# Altium project GCS_H7.PrjPcb (part 1 of 2)
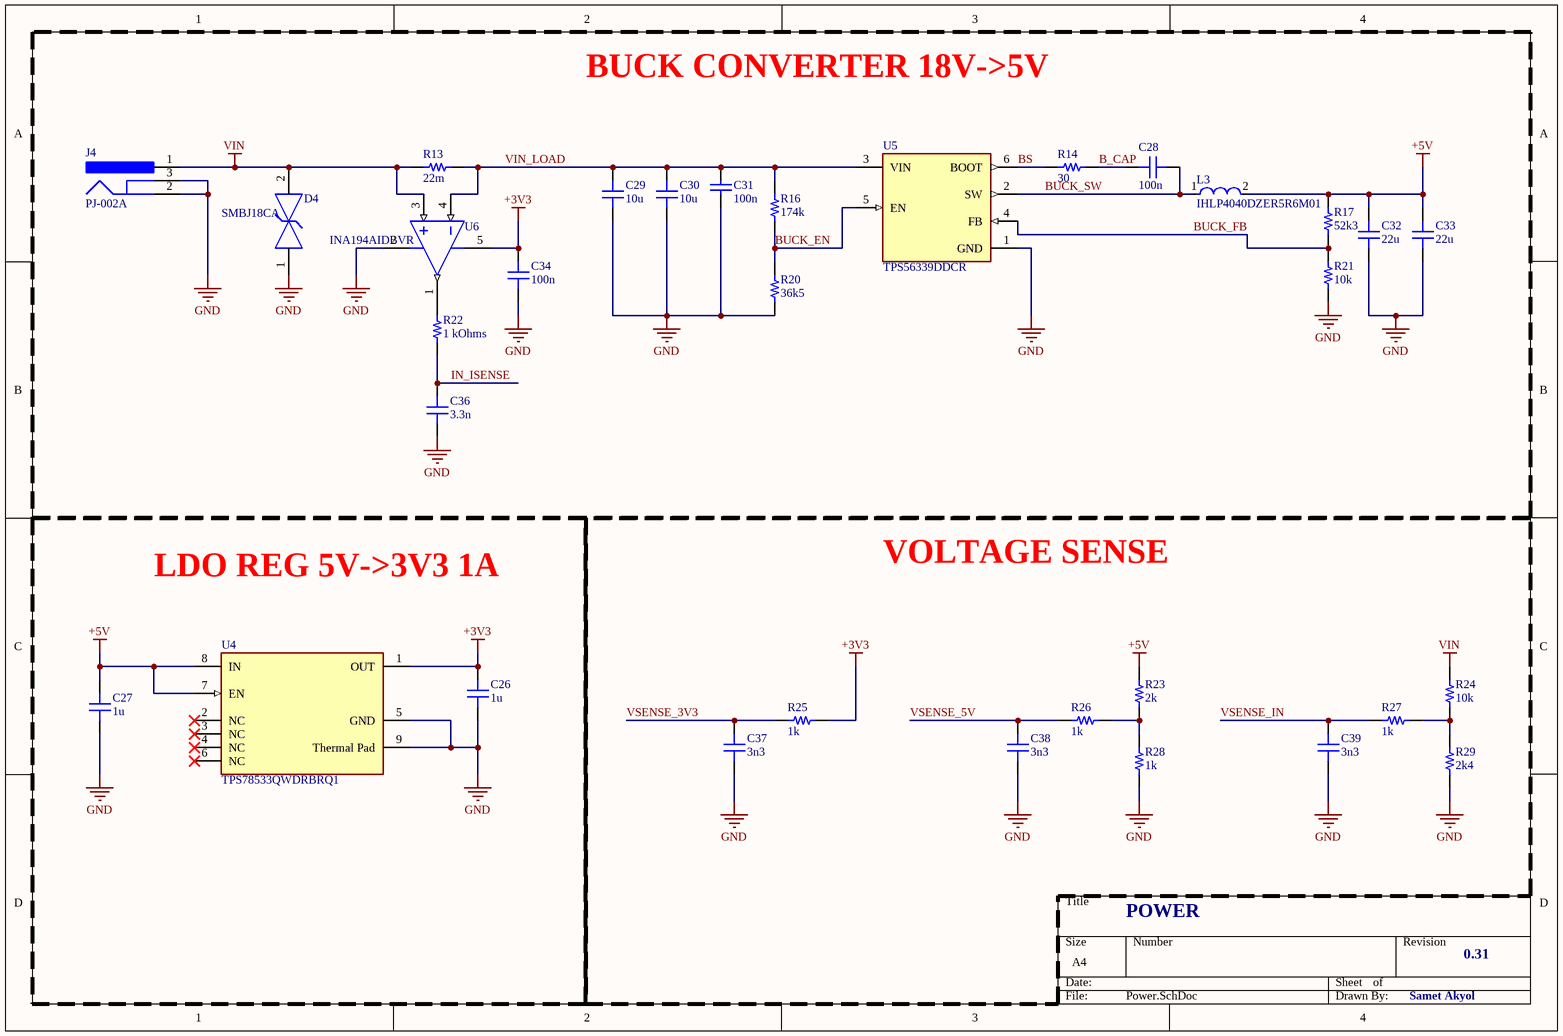
[diagram p0: Power.SchDoc]
5 sheets, 120 parts. Net scope: global (net labels, ports and power ports of the same name join across sheets).
Board file: PCB1.PcbDoc
Sheets:
  Power.SchDoc
  Microcontroller.SchDoc
  Ethernet.SchDoc
  Peripheral.SchDoc
  IcantFindFileName.SchDoc

## Sheet Power.SchDoc
size A4; SheetNumber: 1; SheetTotal: 6

### Parts
C26  1u  [CAP 0603_1608]
C27  1u  [CAP 0603_1608]
C28  100n  [CAP 0603_1608]
C29  10u  [CAP 0805_2012]
C30  10u  [CAP 0805_2012]
C31  100n  [CAPC2013X145X20LL20]
C32  22u  [CAP 0805_2012]
C33  22u  [CAP 0805_2012]
C34  100n  [CAP 0402_1005]
C36  3.3n  [CAP 0402_1005]
C37  3n3  [CAP 0402_1005]
C38  3n3  [CAP 0402_1005]
C39  3n3  [CAP 0402_1005]
D4  SMBJ18CA  [FP-SMBJ-MFG]
J4  PJ-002A  [CUI-PJ-002A_V]
L3  IHLP4040DZER5R6M01  [FP-IHLP-4040DZ-FP_3_124x3-MFG]
R13  22m  [STACKPOLE CSM2512]
R14  30  [RES 0402_1005]
R16  174k  [RES 0402_1005]
R17  52k3  [RES 0603_1608]
R20  36k5  [RES 0402_1005]
R21  10k  [RES 0603_1608]
R22  1 kOhms  [RES 0402_1005]
R23  2k  [RES 0402_1005]
R24  10k  [RES 0402_1005]
R25  1k  [RES 0402_1005]
R26  1k  [RES 0402_1005]
R27  1k  [RES 0402_1005]
R28  1k  [RES 0402_1005]
R29  2k4  [RES 0402_1005]
U4  TPS78533QWDRBRQ1  [FP-DRB0008J-MFG]
U5  TPS56339DDCR  [FP-DDC0006A-MFG]
U6  INA194AIDBVR  [DBV0005A_M]

### Blocks framed on the sheet
BUCK CONVERTER 18V->5V: C28-C34 C36 D4 J4 L3 R13 R14 R16 R17 R20-R22 U5 U6
LDO REG 5V->3V3 1A: C26 C27 U4
VOLTAGE SENSE: C37-C39 R23-R29

### Nets
+3V3: C26.2 C34.2 R25.2 U4.1(OUT) U6.5(V+)
+5V: C27.2 C32.2 C33.2 L3.2 R17.2 R23.1 U4.7(EN) U4.8(IN)
GND: C26.1 C27.1 C29.1 C30.1 C31.1 C32.1 C33.1 C34.1 C36.1 C37.1 C38.1 C39.1 D4.1 J4.2 J4.3 R20.1 R21.1 R28.2 R29.2 U4.5(GND) U4.9(Thermal_Pad) U5.1(GND) U6.2(GND)
VIN: D4.2 J4.1 R13.1 R24.1 U6.3(VIN+)
B_CAP: C28.1 R14.1
BS: R14.2 U5.6(BOOT)
BUCK_EN: R16.1 R20.2 U5.5(EN)
BUCK_FB: R17.1 R21.2 U5.4(FB)
BUCK_SW: C28.2 L3.1 U5.2(SW)
IN_ISENSE: C36.2 R22.1
VIN_LOAD: C29.2 C30.2 C31.2 R13.2 R16.2 U5.3(VIN) U6.4(VIN-)
VSENSE_3V3: C37.2 R25.1
VSENSE_5V: C38.2 R26.1
VSENSE_IN: C39.2 R27.1
NetR22_2: R22.2 U6.1(OUT)
NetR23_2: R23.2 R26.2 R28.1
NetR24_2: R24.2 R27.2 R29.1

Not connected (* = marked no-connect by the designer): U4 2(NC)* 3(NC)* 4(NC)* 6(NC)*

### Notes on the sheet
- POWER
- 0.31
- Samet Akyol

### Library data of the parts
C26 = GRT188R61C106ME13D: CAP CER 10UF 16V X5R 0603; manufacturer: Murata Electronics; Capacitance: 10 µF; Tolerance: ±20%; Part Number: GRT188R61C106ME13D; Value: 1u; Applications: Automotive; componentlink1description: Datasheet; componentlink1url: https://search.murata.co.jp/Ceramy/image/img/A01X/G101/ENG/GRT188R61C106ME13-01.pdf; componentlink2description: DigiKey Link; componentlink2url: https://www.digikey.com/en/products/detail/murata-electronics/GRT188R61C106ME13D/5416740; Device Package: 0603 (1608 Metric); lastupdated: 9.02.2024 20:10:30; Lifecycle Status: Active; Minimum Order: 1; Mounting Type: Surface Mount, MLCC; Operating Temperature: -55°C ~ 85°C; Package / Case: 0603 (1608 Metric); packaging: TapeAndReel; partid: 2515; Part Status: Active; price: 0.06; Ratings: AEC-Q200; series: GRT; Size / Dimension: 0.063" L x 0.031" W (1.60mm x 0.80mm); Supplier 1: DigiKey; Supplier Part Number 1: 490-12318-1-ND; Temperature Coefficient: X5R; Thickness (Max): 0.035" (0.90mm); Voltage - Rated: 16V
C27 = 0603YD105MAT2A: CAP CER 1UF 16V X5R 0603; manufacturer: AVX Corporation; Capacitance: 1µF; Tolerance: ±20%; Part Number: 0603YD105MAT2A; Value: 1u; Applications: General Purpose; componentlink1description: Datasheet; componentlink1url: http://datasheets.avx.com/cx5r.pdf; componentlink2description: DigiKey Link; componentlink2url: http://digikey.com/product-detail/en/avx-corporation/0603YD105MAT2A/478-5319-1-ND/1950986; Device Package: 0603 (1608 Metric); lastupdated: 2.09.2020 01:03:35; Lifecycle Status: Active; Minimum Order: 1; Mounting Type: Surface Mount, MLCC; Operating Temperature: -55°C ~ 85°C; Package / Case: 0603 (1608 Metric); packaging: TapeAndReel; partid: 2864; Part Status: Active; price: 0.02; series: -; Size / Dimension: 0.063" L x 0.032" W (1.60mm x 0.81mm); Supplier 1: DigiKey; Supplier Part Number 1: 478-5319-1-ND; Temperature Coefficient: X5R; Thickness (Max): 0.035" (0.90mm); Voltage - Rated: 16V
C28 = MD0603BW106M100NHT-EM: CAP CER 10UF 10V X5R 0603; manufacturer: Knowles Novacap; Capacitance: 10 µF; Tolerance: ±20%; Part Number: MD0603BW106M100NHT-EM; Value: 100n; Applications: Medical, Non-Critical; componentlink1description: Datasheet; componentlink1url: https://mm.digikey.com/Volume0/opasdata/d220001/medias/docus/5546/MD Series R3.pdf; componentlink2description: DigiKey Link; componentlink2url: https://www.digikey.com/en/products/detail/knowles-novacap/MD0603BW106M100NHT-EM/21406876; Device Package: 0603 (1608 Metric); lastupdated: 9.02.2024 20:08:38; Lifecycle Status: Active; Minimum Order: 1; Mounting Type: Surface Mount, MLCC; Operating Temperature: -55°C ~ 85°C; Package / Case: 0603 (1608 Metric); packaging: TapeAndReel; partid: 56748; price: 0.24; series: MD; Supplier 1: DigiKey; Supplier Part Number 1: 1763-MD0603BW106M100NHT-EMCT-ND; Temperature Coefficient: X5R; Voltage - Rated: 10V
C29 C30 = C2012X6S1C106K125AC: CAP CER 10UF 16V X6S 0805; manufacturer: TDK Corporation; Capacitance: 10 µF; Tolerance: ±10%; Part Number: C2012X6S1C106K125AC; Value: 10u; Applications: General Purpose; componentlink1description: Datasheet; componentlink1url: https://product.tdk.com/info/en/catalog/datasheets/mlcc_commercial_general_en.pdf?ref_disty=digikey; componentlink2description: DigiKey Link; componentlink2url: https://www.digikey.com/en/products/detail/tdk-corporation/C2012X6S1C106K125AC/2733046; Device Package: 0805 (2012 Metric); Features: Low ESL; lastupdated: 9.02.2024 20:16:08; Lifecycle Status: Active; Minimum Order: 1; Mounting Type: Surface Mount, MLCC; Operating Temperature: -55°C ~ 105°C; Package / Case: 0805 (2012 Metric); packaging: TapeAndReel; partid: 2995; Part Status: Active; price: 0.06; series: C; Size / Dimension: 0.079" L x 0.049" W (2.00mm x 1.25mm); Supplier 1: DigiKey; Supplier Part Number 1: 445-7611-1-ND; Temperature Coefficient: X6S; Thickness (Max): 0.057" (1.45mm); Voltage - Rated: 16V
C31 = CMP-2000-07557-1: Chip Capacitor, 0.1 uF, +/- 10%, 50 V, -55 to 125 degC, 0805 (2012 Metric), RoHS, Tape and Reel; Manufacturer: TDK; Voltage Rating: 50V; Dielectric Material: Ceramic; Capacitance: 100nF; Dielectric: X7R; Datasheet Version: 07/2017; Max Operating Temperature: 125degC; RoHSCompliant: True; Min Operating Temperature: -55degC; Case/Package: 0805; Composition: Ceramic; Width: 0.049inch; Thickness: 0.037inch; Datasheet URL: https://product.tdk.com/info/en/catalog/datasheets/mlcc_commercial_general_en.pdf; Height: 0.85mm; Voltage Rating (DC): 50V; Voltage: 50V; Packaging: TapeandReel; Mounting Technology: SurfaceMount; Case Code (Metric): 2012; Length: 2mm; Radiation Hardening: No; Number of Pins: 2; REACH SVHC: NoSVHC; Lead Free: LeadFree; Package Reference: 805; Weight: 0.000194oz; Tolerance: 10%; Package Description: 2-Pin Surface Mount Device, Body 2 x 1.25 mm; Manufacturer URL: http://www.tdk.com/; Package Quantity: 1; Case Code (Imperial): 0805; Mount: SurfaceMount; Depth: 1.25mm; Termination: SMD/SMT
C32 C33 = CL21A226KOQNNNG: CAP CER 22UF 16V X5R 0805; manufacturer: Samsung Electro-Mechanics; Capacitance: 22 µF; Tolerance: ±10%; Part Number: CL21A226KOQNNNG; Value: 22u; Applications: General Purpose; componentlink1description: Datasheet; componentlink1url: //media.digikey.com/pdf/Data%20Sheets/Samsung%20PDFs/CL21A226KOQNNNG_Spec.pdf; componentlink2description: DigiKey Link; componentlink2url: https://www.digikey.com/en/products/detail/samsung-electro-mechanics/CL21A226KOQNNNG/3894433; Device Package: 0805 (2012 Metric); lastupdated: 9.02.2024 20:16:07; Lifecycle Status: Active; Minimum Order: 1; Mounting Type: Surface Mount, MLCC; Operating Temperature: -55°C ~ 85°C; Package / Case: 0805 (2012 Metric); packaging: TapeAndReel; partid: 3000; Part Status: Active; price: 0.06; series: CL; Size / Dimension: 0.079" L x 0.049" W (2.00mm x 1.25mm); Supplier 1: DigiKey; Supplier Part Number 1: 1276-7092-1-ND; Temperature Coefficient: X5R; Thickness (Max): 0.055" (1.40mm); Voltage - Rated: 16V
C34 C36-C39 = GRM155C71A105KE11D: CAP CER 1UF 10V X7S 0402; manufacturer: Murata Electronics; Capacitance: 1 µF; Tolerance: ±10%; Part Number: GRM155C71A105KE11D; Applications: General Purpose; componentlink1description: Datasheet; componentlink1url: https://search.murata.co.jp/Ceramy/image/img/A01X/G101/ENG/GRM155C71A105KE11-01.pdf; componentlink2description: DigiKey Link; componentlink2url: https://www.digikey.com/en/products/detail/murata-electronics/GRM155C71A105KE11D/6606086; Device Package: 0402 (1005 Metric); lastupdated: 9.02.2024 20:04:38; Lifecycle Status: Active; Minimum Order: 1; Mounting Type: Surface Mount, MLCC; Operating Temperature: -55°C ~ 125°C; Package / Case: 0402 (1005 Metric); packaging: TapeAndReel; partid: 1749; Part Status: Active; price: 0.01; series: GRM; Size / Dimension: 0.039" L x 0.020" W (1.00mm x 0.50mm); Supplier 1: DigiKey; Supplier Part Number 1: 490-14457-1-ND; Temperature Coefficient: X7S; Thickness (Max): 0.024" (0.60mm); Voltage - Rated: 10V
  C34: Value: 100n
  C36: Value: 3.3n
  C37-C39: Value: 3n3
D4 = CMP-08607-000021-1: TVS DIODE 18V 29.2V DO214AA; Manufacturer: Littelfuse Inc; Number Of Channels: 1; Peak Pulse Power: 600W; Max Junction Temp: +150°C; Peak Pulse Current: 20.6A; Direction: Bidirectional; Breakdown Voltage: 20V; RoHS: TRUE; Lead Free: Yes; Category: Diode; Clamping Voltage: 29.2V; Height: 2.61mm; Manufacturer Part Number: SMBJ18CA; Reverse Standoff Voltage: 18V; Device Class L3: unset; Device Class L2: TVS Diodes; Package: SMBJ; Digikey Description: TVS DIODE 18V 29.2V DO214AA; Device Class L1: Circuit Protection; ComponentLink2Description: Datasheet; ComponentLink2URL: https://www.littelfuse.com/~/media/electronics/datasheets/tvs_diodes/littelfuse_tvs_diode_smbj_datasheet.pdf.pdf; Temperature: -65°C to +150°C; Temperature Range High: +150°C; Mouser Description: SMBJ Series 29.2 V 0.6 kW Surface Mount Bi-Directional TVS Diode - DO-214AA; Automotive: No; Octopart: https://octopart.com/smbj18ca-littelfuse-350695; Temperature Range Low: -65°C
J4 = CMP-2000-06895-2: Through Hole Right Angle DC Power Jack, 2.5 A, 2 mm Center Pin, 3 Position, -25 to 85 degC, RoHS, Bulk; Manufacturer: CUIInc.; Brand: CUI; Inside Contact Diameter: 2mm; Voltage Rating: 24V; Outside Contact Diameter: 6.5mm; Current Rating: 2.5A; Insulation Resistance: 50MOhms; Contact Gender: Male; Connector Type: DCPowerJack; Datasheet Version: Rev. 1.03, 04/2016; Housing Material: PolybutyleneTerephthalate(PBT); Operating Temperature Range: -25Cto+85C; Termination Style: ThroughHole; Product Category: DCPowerConnectors; Mounting Technology: ThroughHole; Mounting Style: ThroughHole; Factory Pack Quantity: 500; Contact Plating: Nickel; Package Reference: PJ-002A; Mounting Angle: Right; Package Description: 3-Pin Through Hole Device, Body 14.4 x 9 mm, Height 11 mm; Flammability Rating: UL94V-0; Manufacturer URL: http://www.cui.com/; Product: Jacks; Contact Material: Copper; Datasheet URL: http://www.cui.com/product/resource/pj-002a.pdf; RoHS: True
L3 = CMP-02424-000424-1: Commercial Inductors, High Saturation Series 5.6uH 8.5A 19.3mΩ 20%; Shielding: Shielded; Core Material: Ferrite; Max DC Current: 16A; Test Frequency: 100kHz; DC Resistance (DCR): 19.3mR; Self Resonant Frequency: 5MHz; Mount: Surface Mount; Current Rating: 8.5A; Termination: SMD/SMT; Weight: 0.070548oz; Width: 10.3mm; Package Quantity: 500; Max Operating Temperature: 125°C; Packaging: Tape and Reel; Case/Package: 4040; Min Operating Temperature: -55°C; Lead Free: Lead Free; Inductance Tolerance: 20%; Height - Seated (Max): 0.157inch; Depth: 10.3mm; Length: 0.43inch; Radiation Hardening: No; Tolerance: 20%; Height: 4mm; Number of Pins: 4040; Saturation Current: 16A; Military Standard: Not; Inductance: 5.6uH; RMS Current (Irms): 8.5A
R13 = CSM2512FT22L0: RES 0.022 OHM 1% 3W 2512; manufacturer: Stackpole Electronics Inc; Resistance: 22 mOhms; Temperature Coefficient: ±50ppm/°C; value: 22 mOhms; Part Number: CSM2512FT22L0; componentlink1description: Datasheet; componentlink1url: https://www.seielect.com/catalog/sei-csm.pdf; componentlink2description: DigiKey Link; componentlink2url: https://www.digikey.com/en/products/detail/stackpole-electronics-inc/CSM2512FT22L0/13930221; Composition: Metal Element; Device Package: 2512 (6332 Metric); Features: Automotive AEC-Q200, Current Sense; Height - Seated (Max): 0.043" (1.10mm); lastupdated: 3.06.2024 20:27:03; Lifecycle Status: Active; Minimum Order: 1; Number of Terminations: 2; Operating Temperature: -55°C ~ 170°C; Package / Case: 2512 (6332 Metric); packaging: TapeAndReel; Part Status: Active; Power (Watts): 3W; price: 0.19; Ratings: AEC-Q200; series: CSM; Size / Dimension: 0.252" L x 0.126" W (6.40mm x 3.20mm); Supplier 1: DigiKey; Supplier Part Number 1: 738-CSM2512FT22L0CT-ND; Supplier Device Package: 2512; Tolerance: ±1%
R14 R23-R29 = CPF0402B1K0E: RES SMD 1K OHM 0.1% 1/16W 0402; Manufacturer: TE Connectivity Passive Product; Power (Watts): 0.063W, 1/16W; Resistance: 1 kOhms; Temperature Coefficient: ±25ppm/°C; Part Number: CPF0402B1K0E; ComponentLink1Description: Datasheet; ComponentLink1URL: https://www.te.com/commerce/DocumentDelivery/DDEController?Action=srchrtrv&DocNm=1773200&DocType=DS&DocLang=English; ComponentLink2Description: DigiKey Link; ComponentLink2URL: https://www.digikey.com/en/products/detail/te-connectivity-passive-product/CPF0402B1K0E/4966468; Composition: Thin Film; Device Package: 0402 (1005 Metric); Height - Seated (Max): 0.014" (0.35mm); LastUpdated: 9.02.2024 20:30:24; Lifecycle Status: Active; Minimum Order: 1; Number of Terminations: 2; Operating Temperature: -55°C ~ 155°C; Package / Case: 0402 (1005 Metric); Packaging: TapeAndReel; PartId: 2470; Part Status: Active; Price: 0.10; Series: CPF, Neohm; Size / Dimension: 0.039" L x 0.020" W (1.00mm x 0.50mm); Supplier 1: DigiKey; Supplier Part Number 1: A119928CT-ND; Supplier Device Package: 0402; Tolerance: ±0.1%
  R14: Value: 30
  R23: Value: 2k
  R24: Value: 10k
  R25-R28: Value: 1k
  R29: Value: 2k4
R16 = RP73PF1E174KBTD: RES 174K OHM 0.1% 1/10W 0402; Manufacturer: TE Connectivity Passive Product; Power (Watts): 0.1W, 1/10W; Resistance: 174 kOhms; Temperature Coefficient: ±25ppm/°C; Part Number: RP73PF1E174KBTD; Value: 174k; ComponentLink1Description: Datasheet; ComponentLink1URL: https://www.te.com/commerce/DocumentDelivery/DDEController?Action=srchrtrv&DocNm=1773272&DocType=DS&DocLang=English; ComponentLink2Description: DigiKey Link; ComponentLink2URL: https://www.digikey.com/en/products/detail/te-connectivity-passive-product/RP73PF1E174KBTD/8261076; Composition: Thin Film; Device Package: 0402 (1005 Metric); Height - Seated (Max): 0.014" (0.35mm); LastUpdated: 9.02.2024 20:30:24; Lifecycle Status: Active; Minimum Order: 1; Number of Terminations: 2; Operating Temperature: -55°C ~ 155°C; Package / Case: 0402 (1005 Metric); Packaging: TapeAndReel; PartId: 2449; Part Status: Active; Price: 0.08; Series: RP73, Holsworthy; Size / Dimension: 0.039" L x 0.020" W (1.00mm x 0.50mm); Supplier 1: DigiKey; Supplier Part Number 1: A127534CT-ND; Supplier Device Package: 0402; Tolerance: ±0.1%
R17 R21 = RNCS0603BKE10K0: RES 10K OHM 0.1% 1/16W 0603; Manufacturer: Stackpole Electronics Inc; Power (Watts): 0.063W, 1/16W; Resistance: 10 kOhms; Temperature Coefficient: ±25ppm/°C; Part Number: RNCS0603BKE10K0; ComponentLink1Description: Datasheet; ComponentLink1URL: https://www.seielect.com/catalog/sei-rncs_rnch.pdf; ComponentLink2Description: DigiKey Link; ComponentLink2URL: https://www.digikey.com/en/products/detail/stackpole-electronics-inc/RNCS0603BKE10K0/1708836; Composition: Thin Film; Device Package: 0603 (1608 Metric); Features: Anti-Corrosive, Automotive AEC-Q200, Moisture Resistant; Height - Seated (Max): 0.022" (0.55mm); LastUpdated: 9.02.2024 20:43:37; Lifecycle Status: Active; Minimum Order: 1; Number of Terminations: 2; Operating Temperature: -55°C ~ 155°C; Package / Case: 0603 (1608 Metric); Packaging: TapeAndReel; PartId: 4838; Part Status: Active; Price: 0.06; Ratings: AEC-Q200; Series: RNCS; Size / Dimension: 0.061" L x 0.031" W (1.55mm x 0.80mm); Supplier 1: DigiKey; Supplier Part Number 1: RNCS0603BKE10K0CT-ND; Supplier Device Package: 0603; Tolerance: ±0.1%
  R17: Value: 52k3
  R21: Value: 10k
R20 = RN73C1E36K5BTD: RES SMD 36.5KOHM 0.1% 1/16W 0402; Manufacturer: TE Connectivity Passive Product; Power (Watts): 0.063W, 1/16W; Resistance: 36.5 kOhms; Temperature Coefficient: ±10ppm/°C; Part Number: RN73C1E36K5BTD; Value: 36k5; ComponentLink1Description: Datasheet; ComponentLink1URL: https://www.te.com/commerce/DocumentDelivery/DDEController?Action=srchrtrv&DocNm=1773270&DocType=DS&DocLang=English; ComponentLink2Description: DigiKey Link; ComponentLink2URL: https://www.digikey.com/en/products/detail/te-connectivity-passive-product/RN73C1E36K5BTD/6558325; Composition: Thin Film; Device Package: 0402 (1005 Metric); Height - Seated (Max): 0.014" (0.35mm); LastUpdated: 9.02.2024 20:30:22; Lifecycle Status: Active; Minimum Order: 1; Number of Terminations: 2; Operating Temperature: -55°C ~ 155°C; Package / Case: 0402 (1005 Metric); Packaging: TapeAndReel; PartId: 2980; Part Status: Active; Price: 0.26; Series: RN73, Holsworthy; Size / Dimension: 0.039" L x 0.020" W (1.00mm x 0.50mm); Supplier 1: DigiKey; Supplier Part Number 1: A124638CT-ND; Supplier Device Package: 0402; Tolerance: ±0.1%
R22 = CPF0402B1K0E: RES SMD 1K OHM 0.1% 1/16W 0402; Manufacturer: TE Connectivity Passive Product; Power (Watts): 0.063W, 1/16W; Temperature Coefficient: ±25ppm/°C; Part Number: CPF0402B1K0E; Value: 1 kOhms; ComponentLink1Description: Datasheet; ComponentLink1URL: https://www.te.com/commerce/DocumentDelivery/DDEController?Action=srchrtrv&DocNm=1773200&DocType=DS&DocLang=English; ComponentLink2Description: DigiKey Link; ComponentLink2URL: https://www.digikey.com/en/products/detail/te-connectivity-passive-product/CPF0402B1K0E/4966468; Composition: Thin Film; Device Package: 0402 (1005 Metric); Height - Seated (Max): 0.014" (0.35mm); LastUpdated: 9.02.2024 20:30:24; Lifecycle Status: Active; Minimum Order: 1; Number of Terminations: 2; Operating Temperature: -55°C ~ 155°C; Package / Case: 0402 (1005 Metric); Packaging: TapeAndReel; PartId: 2470; Part Status: Active; Price: 0.10; Resistance: 1 kOhms; Series: CPF, Neohm; Size / Dimension: 0.039" L x 0.020" W (1.00mm x 0.50mm); Supplier 1: DigiKey; Supplier Part Number 1: A119928CT-ND; Supplier Device Package: 0402; Tolerance: ±0.1%
U4 = CMP-00370-117877499-1: TPS78533QWDRBRQ1 Automotive, 1-A high-accuracy adjustable low-dropout (LDO) linear regulator 8-SON -40 to 150; Manufacturer Lifecycle Status: ACTIVE; Min Supply Voltage: 4.05V; Max Junction Temperature (Tj): 150°C; Max Supply Voltage: 6V; Number of Outputs: 1; Output Current: 1A; Dropout Voltage: 315mV; Accuracy: 0.5%; Output Voltage: 3.3V; Min Operating Temperature: -40°C; Lifecycle Status: Production; Length: 3mm; Height: 1mm; Thickness: 880µm; Max Operating Temperature: 150°C; Width: 3mm; NexarPartId: 117877499; Number of Pins: 8
U5 = CMP-04918-000012-1: PWR MGMT SPECIALIZED REGULATOR; Manufacturer: Texas Instruments; Output Type: AdjustableProgrammable; Max Supply Voltage: 24V; Min Supply Voltage: 4.5V; Nominal Supply Current: 98uA; Max Duty Cycle: 97%; Number Of Outputs: 1; Output Current: 3A; Switching Topology: Buck; Standoff Height: 0mm; Switching Frequency: 500kHz; Output Voltage: 0.8-16V; Max Junction Temp: +125°C; ComponentLink2Description: Datasheet; ComponentLink2URL: http://www.ti.com/lit/ds/symlink/tps56339.pdf; Package: DDC0006A; RoHS: TRUE; Temperature: -40°C to +125°C; Temperature Range Low: -40°C; Device Class L3: Voltage Regulators - Switching; Temperature Range High: +125°C; Device Class L2: Power Management ICs; Device Class L1: Integrated Circuits (ICs); Category: IC; Manufacturer Part Number: TPS56339DDCR; Octopart: https://octopart.com/tps56339ddcr-texas+instruments-101466410; Automotive: No; Height: 1.1mm; Digikey Description: PWR MGMT SPECIALIZED REGULATOR; Lead Free: Yes; Mouser Description: 4.5-V to 24-V input, 3-A output synchronous buck converter 6-SOT-23-THIN -40 to 125
U6 = CMP-0704-00036-2: Voltage Output High-Side Measurement Current Shunt Monitor, 2.7 to 18 V, -40 to 125 degC, 5-pin SOT23 (DBV5), Green (RoHS & no Sb/Br); Manufacturer: Texas Instruments; Common Mode Range(Min)(V): -16; Vs(Max)(V): 18; Gain(V/V): 50; Quiescent Current (+/-)(Typ)(mA): 0.7; Rating: Catalog; Common Mode Range(Max)(V): 80; Input Offset (+/-)(Max)(uV): 2000; Small-Signal Bandwidth(Typ)(MHz): 0.3; Vs(Min)(V): 2.7; Code_JEDEC: MO-178; Mounting Technology: Surface Mount; ComponentLink1Description: Manufacturer URL; DatasheetVersion: SBOS307F; PackageReference: DBV0005A; SubFamily: Current Shunt Monitor; ComponentLink3Description: Package Specification; ComponentLink2Description: Datasheet; Eco-Plan: Green (RoHS & no Sb/Br); ComponentLink2URL: http://www.ti.com/general/docs/lit/getliterature.tsp?genericPartNumber=INA194&fileType=pdf; ComponentLink1URL: http://www.ti.com/; PartNumber: INA194AIDBVR; PackageVersion: 4073253-4/K, 03/2006; ComponentLink3URL: http://www.ti.com/lit/ml/mpds018j/mpds018j.pdf; PackageDescription: 5-Pin Plastic Small Outline, Body 1.6 x 2.9 mm, Pitch 0.95 mm; CMRR(Min)(dB): 80; Output Type: Voltage

## Sheet Microcontroller.SchDoc
size A4; SheetNumber: 2; SheetTotal: 5
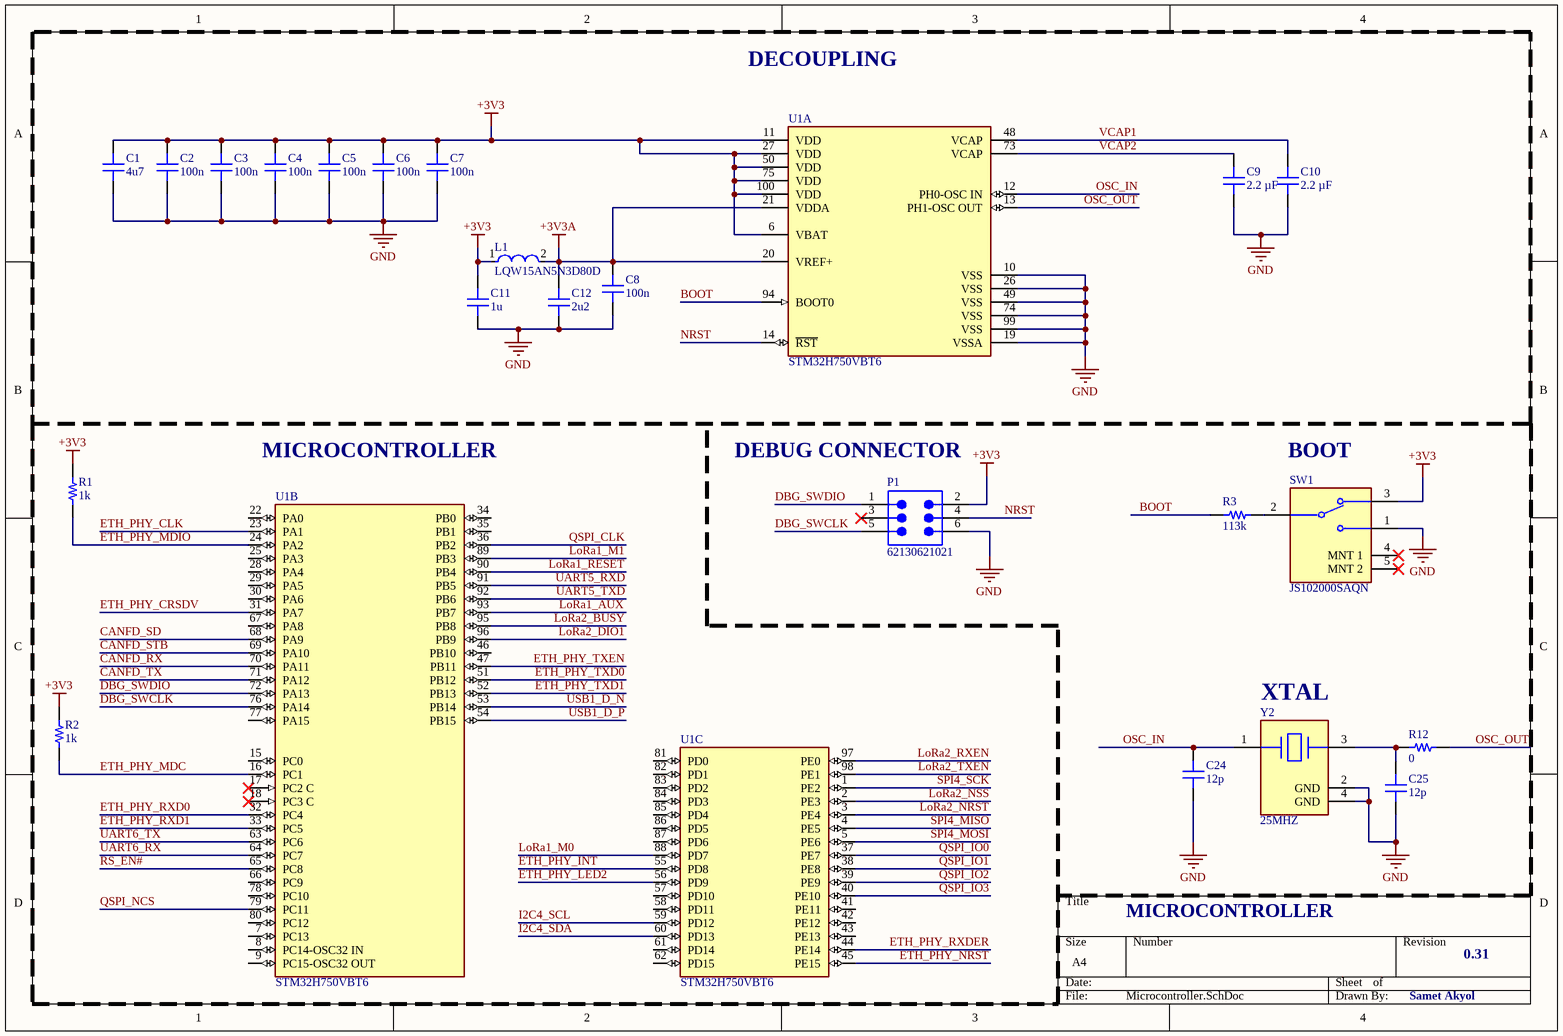
[diagram p1: Microcontroller.SchDoc]

### Parts
C1  4u7  [CAP 0402_1005]
C2  100n  [CAP 0402_1005]
C3  100n  [CAP 0402_1005]
C4  100n  [CAP 0402_1005]
C5  100n  [CAP 0402_1005]
C6  100n  [CAP 0402_1005]
C7  100n  [CAP 0402_1005]
C8  100n  [CAP 0402_1005]
C9  2.2 µF  [CAP 0402_1005]
C10  2.2 µF  [CAP 0402_1005]
C11  1u  [CAP 0402_1005]
C12  2u2  [CAP 0402_1005]
C24  12p  [CAP 0402_1005]
C25  12p  [CAP 0402_1005]
L1  LQW15AN5N3D80D  [FP-LQW15AN_80-MFG]
P1  62130621021  [62130621021]
R1  1k  [RES 0402_1005]
R2  1k  [RES 0402_1005]
R3  113k  [RES 0402_1005]
R12  0  [RES 0402_1005]
SW1  JS102000SAQN  [FP-JS102000SAQN-MFG]
U1  STM32H750VBT6  [FP-LQFP100-1L-MFG]  (parts A,B,C of 3)
Y2  25MHZ  [FP-ABM8G-MFG]

### Blocks framed on the sheet
DECOUPLING: C1-C12 L1 U1

### Nets
+3V3: C1.2 C2.2 C3.2 C4.2 C5.2 C6.2 C7.2 C11.2 L1.1 P1.2 R1.1 R2.1 SW1.3 U1.6(VBAT) U1.11(VDD) U1.27(VDD) U1.50(VDD) U1.75(VDD) U1.100(VDD)
+3V3A: C8.2 C12.2 L1.2 U1.20(VREF+) U1.21(VDDA)
GND: C1.1 C2.1 C3.1 C4.1 C5.1 C6.1 C7.1 C8.1 C9.1 C10.1 C11.1 C12.1 C24.1 C25.1 P1.6 SW1.1 U1.10(VSS) U1.19(VSSA) U1.26(VSS) U1.49(VSS) U1.74(VSS) U1.99(VSS) Y2.2(GND) Y2.4(GND)
BOOT: R3.2 U1.94(BOOT0)
CANFD_RX: U1.70(PA11)
CANFD_SD: U1.68(PA9)
CANFD_STB: U1.69(PA10)
CANFD_TX: U1.71(PA12)
DBG_SWCLK: P1.5 U1.76(PA14)
DBG_SWDIO: P1.1 U1.72(PA13)
ETH_PHY_CLK: U1.23(PA1)
ETH_PHY_CRSDV: U1.31(PA7)
ETH_PHY_INT: U1.55(PD8)
ETH_PHY_LED2: U1.56(PD9)
ETH_PHY_MDC: R2.2 U1.16(PC1)
ETH_PHY_MDIO: R1.2 U1.24(PA2)
ETH_PHY_NRST: U1.45(PE15)
ETH_PHY_RXD0: U1.32(PC4)
ETH_PHY_RXD1: U1.33(PC5)
ETH_PHY_RXDER: U1.44(PE14)
ETH_PHY_TXD0: U1.51(PB12)
ETH_PHY_TXD1: U1.52(PB13)
ETH_PHY_TXEN: U1.47(PB11)
I2C4_SCL: U1.59(PD12)
I2C4_SDA: U1.60(PD13)
LoRa1_AUX: U1.93(PB7)
LoRa1_M0: U1.88(PD7)
LoRa1_M1: U1.89(PB3)
LoRa1_RESET: U1.90(PB4)
LoRa2_BUSY: U1.95(PB8)
LoRa2_DIO1: U1.96(PB9)
LoRa2_NRST: U1.3(PE4)
LoRa2_NSS: U1.2(PE3)
LoRa2_RXEN: U1.97(PE0)
LoRa2_TXEN: U1.98(PE1)
NRST: P1.4 U1.14(~{RST})
OSC_IN: C24.2 U1.12(PH0-OSC_IN) Y2.1
OSC_OUT: R12.1 U1.13(PH1-OSC_OUT)
QSPI_CLK: U1.36(PB2)
QSPI_IO0: U1.37(PE7)
QSPI_IO1: U1.38(PE8)
QSPI_IO2: U1.39(PE9)
QSPI_IO3: U1.40(PE10)
QSPI_NCS: U1.79(PC11)
RS_EN#: U1.65(PC8)
SPI4_MISO: U1.4(PE5)
SPI4_MOSI: U1.5(PE6)
SPI4_SCK: U1.1(PE2)
UART5_RXD: U1.91(PB5)
UART5_TXD: U1.92(PB6)
UART6_RX: U1.64(PC7)
UART6_TX: U1.63(PC6)
USB1_D_N: U1.53(PB14)
USB1_D_P: U1.54(PB15)
VCAP1: C10.2 U1.48(VCAP)
VCAP2: C9.2 U1.73(VCAP)
NetC25_2: C25.2 R12.2 Y2.3
NetR3_1: R3.1 SW1.2(C)

Not connected (* = marked no-connect by the designer): P1 3*; SW1 4(MNT_1)* 5(MNT_2)*; U1 7(PC13) 8(PC14-OSC32_IN) 9(PC15-OSC32_OUT) 15(PC0) 17(PC2_C)* 18(PC3_C)* 22(PA0) 25(PA3) 28(PA4) 29(PA5) 30(PA6) 34(PB0) 35(PB1) 41(PE11) 42(PE12) 43(PE13) 46(PB10) 57(PD10) 58(PD11) 61(PD14) 62(PD15) 66(PC9) 67(PA8) 77(PA15) 78(PC10) 80(PC12) 81(PD0) 82(PD1) 83(PD2) 84(PD3) 85(PD4) 86(PD5) 87(PD6)

### Notes on the sheet
- MICROCONTROLLER
- (near P1) DEBUG CONNECTOR
- (near SW1) BOOT
- (near Y2) XTAL
- 0.31
- Samet Akyol

### Library data of the parts
C1-C8 C11 C12 C24 C25 = CL05B104KP5VPNC: CAP CER 100NF 10V X7R 0402; manufacturer: Samsung Electro-Mechanics; Capacitance: 0.1 µF; Tolerance: ±10%; Part Number: CL05B104KP5VPNC; Applications: Automotive; componentlink1description: Datasheet; componentlink1url: https://mm.digikey.com/Volume0/opasdata/d220001/medias/docus/5458/CL05B104KP5VPNC_Spec.pdf; componentlink2description: DigiKey Link; componentlink2url: https://www.digikey.com/en/products/detail/samsung-electro-mechanics/CL05B104KP5VPNC/20498482; Device Package: 0402 (1005 Metric); lastupdated: 9.02.2024 20:03:17; Lifecycle Status: Active; Minimum Order: 1; Mounting Type: Surface Mount, MLCC; Operating Temperature: -55°C ~ 125°C; Package / Case: 0402 (1005 Metric); packaging: TapeAndReel; partid: 56690; price: 0.01; Ratings: AEC-Q200; series: CL; Size / Dimension: 0.039" L x 0.020" W (1.00mm x 0.50mm); Supplier 1: DigiKey; Supplier Part Number 1: 1276-CL05B104KP5VPNCCT-ND; Temperature Coefficient: X7R; Thickness (Max): 0.022" (0.55mm); Voltage - Rated: 10V
  C1: Value: 4u7
  C2-C8: Value: 100n
  C11: Value: 1u
  C12: Value: 2u2
  C24 C25: Value: 12p
C9 C10 = CL05A225KO5NQNC: CAP CER 2.2UF 16V X5R 0402; manufacturer: Samsung Electro-Mechanics; Tolerance: ±10%; Part Number: CL05A225KO5NQNC; Value: 2.2 µF; Applications: General Purpose; Capacitance: 2.2 µF; componentlink1description: Datasheet; componentlink1url: http://www.samsungsem.com/kr/support/product-search/mlcc/CL05A225KO5NQNC.jsp; componentlink2description: DigiKey Link; componentlink2url: https://www.digikey.com/en/products/detail/samsung-electro-mechanics/CL05A225KO5NQNC/3887119; Device Package: 0402 (1005 Metric); lastupdated: 9.02.2024 20:04:38; Lifecycle Status: Active; Minimum Order: 1; Mounting Type: Surface Mount, MLCC; Operating Temperature: -55°C ~ 85°C; Package / Case: 0402 (1005 Metric); packaging: TapeAndReel; partid: 1761; Part Status: Active; price: 0.03; series: CL; Size / Dimension: 0.039" L x 0.020" W (1.00mm x 0.50mm); Supplier 1: DigiKey; Supplier Part Number 1: 1276-1461-1-ND; Temperature Coefficient: X5R; Thickness (Max): 0.022" (0.55mm); Voltage - Rated: 16V
L1 = CMP-06042-007060-1: Wire Wound RF Inductor 5.3nH ±0.5nH 1770mA 0.04Ω 0402 (1005); Max DC Current: 1.77A; Test Frequency: 100MHz; Q Factor: 35; Shielding: Unshielded; Self Resonant Frequency: 8GHz; Core Material: Non-Magnetic; DC Resistance (DCR): 40mR; Case/Package: 0402; Height - Seated (Max): 0.024inch; Height: 0.5mm; Mount: Surface Mount; Inductance: 5.3nH; Width: 0.5mm; Package Quantity: 1; Packaging: Tape and Reel; Current Rating: 1.77A; Case Code (Metric): 1005; Length: 0.039inch; Case Code (Imperial): 0402; Resistor Type: Wirewound; Max Operating Temperature: 125°C; Termination: SMD/SMT; Min Operating Temperature: -55°C
P1 = CMP-1502-00936-3: NexarPartId: 116077963
R1-R3 R12 = RP73PF1E249KBTD: RES 249K OHM 0.1% 1/10W 0402; Manufacturer: TE Connectivity Passive Product; Power (Watts): 0.1W, 1/10W; Resistance: 249 kOhms; Temperature Coefficient: ±25ppm/°C; Part Number: RP73PF1E249KBTD; ComponentLink1Description: Datasheet; ComponentLink1URL: https://www.te.com/commerce/DocumentDelivery/DDEController?Action=srchrtrv&DocNm=1773272&DocType=DS&DocLang=English; ComponentLink2Description: DigiKey Link; ComponentLink2URL: https://www.digikey.com/en/products/detail/te-connectivity-passive-product/RP73PF1E249KBTD/8261091; Composition: Thin Film; Device Package: 0402 (1005 Metric); Height - Seated (Max): 0.014" (0.35mm); LastUpdated: 9.02.2024 20:30:24; Lifecycle Status: Active; Minimum Order: 1; Number of Terminations: 2; Operating Temperature: -55°C ~ 155°C; Package / Case: 0402 (1005 Metric); Packaging: TapeAndReel; PartId: 2418; Part Status: Active; Price: 0.07; Series: RP73, Holsworthy; Size / Dimension: 0.039" L x 0.020" W (1.00mm x 0.50mm); Supplier 1: DigiKey; Supplier Part Number 1: A127549CT-ND; Supplier Device Package: 0402; Tolerance: ±0.1%
  R1 R2: Value: 1k
  R3: Value: 113k
  R12: Value: 0
SW1 = CMP-10038-000025-1: SWITCH SLIDE SPDT 1MA 5V; Actuator Material: Nylon; Contact Resistance: 70mR; Electrical Life: 15000Cycles; Actuator Length: 1.5mm; Switch Function: On-On; Actuator Type: Standard; Actuator Color: Black; Current Rating: 1mA; Throw Configuration: SPDT; Termination: Gull Wing; Housing Material: Nylon; Max Operating Temperature: 85°C; Max Voltage Rating (DC): 5V; Voltage Rating (DC): 5V; Contact Plating: Silver; Radiation Hardening: No; Package Quantity: 1; REACH SVHC: No SVHC; RoHS Compliant: Yes; Orientation: Right Angle; Max Current Rating: 1mA; Case/Package: SMD/SMT; Contact Current Rating: 1mA; Contact Material: Copper Alloy; Mount: Surface Mount; Flammability Rating: UL94 V-2; Packaging: Tape and Reel; Switch Travel: 1.5mm; Length: 7.8mm; Series: JS; Min Operating Temperature: -20°C; Depth: 4.82mm
U1 = CMP-12105-000017-1: IC MCU 32BIT 128KB FLASH 100LQFP; Manufacturer: STMicroelectronics; Number Of Uart Channels: 9; Number Of I/Os: 82; Max Junction Temp: +125°C; Data Bus Width: 32bits; Ram Size: 1MBytes; Min Supply Voltage: 1.62V; Number Of Spi Channels: 6; Number Of Adc Channels: 36; Max Supply Voltage: 3.6V; Standoff Height: 0.05mm; Interface: I2C,SPI,UART,USART,CAN,USB,LIN,IrDA,Ethernet,I2S,Other; Number Of A/D Converters: 3; Number Of I2C Channels: 4; Memory Size: 128KBytes; Frequency: 480MHz; Number Of Timers/Counters: 20; Number Of Ethernet Channels: 1; Core Architecture: ARM Cortex-M7; Number Of Usb Channels: 2; Number Of Pwm Channels: 42; Ambient Temperature Range High: +85°C; Temperature: -40°C to +125°C; ComponentLink2URL: https://www.st.com/resource/en/datasheet/stm32h750vb.pdf; Device Class L2: Embedded Processors and Controllers; Temperature Range Low: -40°C; Octopart: https://octopart.com/stm32h750vbt6-stmicroelectronics-94048547; Category: IC; Manufacturer Part Number: STM32H750VBT6; Height: 1.6mm; Lead Free: Yes; Device Class L1: Integrated Circuits (ICs); Digikey Description: IC MCU 32BIT 128KB FLASH 100LQFP; RoHS: TRUE; Ambient Temperature Range Low: -40°C; Device Class L3: Microcontrollers; ComponentLink2Description: Datasheet; Mouser Description: MCU 32-Bit STM32H750VB ARM Cortex M7 RISC 128KB Flash 1.8V/2.5V/3.3V 100-Pin LQFP Tray; Number Of Cores: 1; Automotive: No; Memory Type: FLASH; Package: LQFP100-1L; Temperature Range High: +125°C
Y2 = CMP-2000-05733-3: Crystal 25MHz ±20ppm (Tol) ±30ppm (Stability) 18pF FUND 60Ω 4-Pin SMD T/R; Series Resistance: 60R; Length: 3.2mm; Depth: 2.5mm; Packaging: Tape and Reel; Min Operating Temperature: -40°C; Operating Frequency: 25 MHz; Lead Free: Lead Free; Number of Pins: 4; Frequency Tolerance: 20ppm; Radiation Hardening: No; Max Operating Temperature: 85°C; Termination: SMD/SMT; Frequency Stability: 30ppm; Frequency: 25MHz; Series: ABM8G; Mount: Surface Mount; Package Quantity: 1000; Height: 0.039inch; Width: 0.098inch; Case/Package: CSMD; ESR (Equivalent Series Resistance): 60R; Load Capacitance: 18pF; Tolerance: 20ppm

## Sheet Ethernet.SchDoc
size A4; SheetNumber: 3; SheetTotal: 5
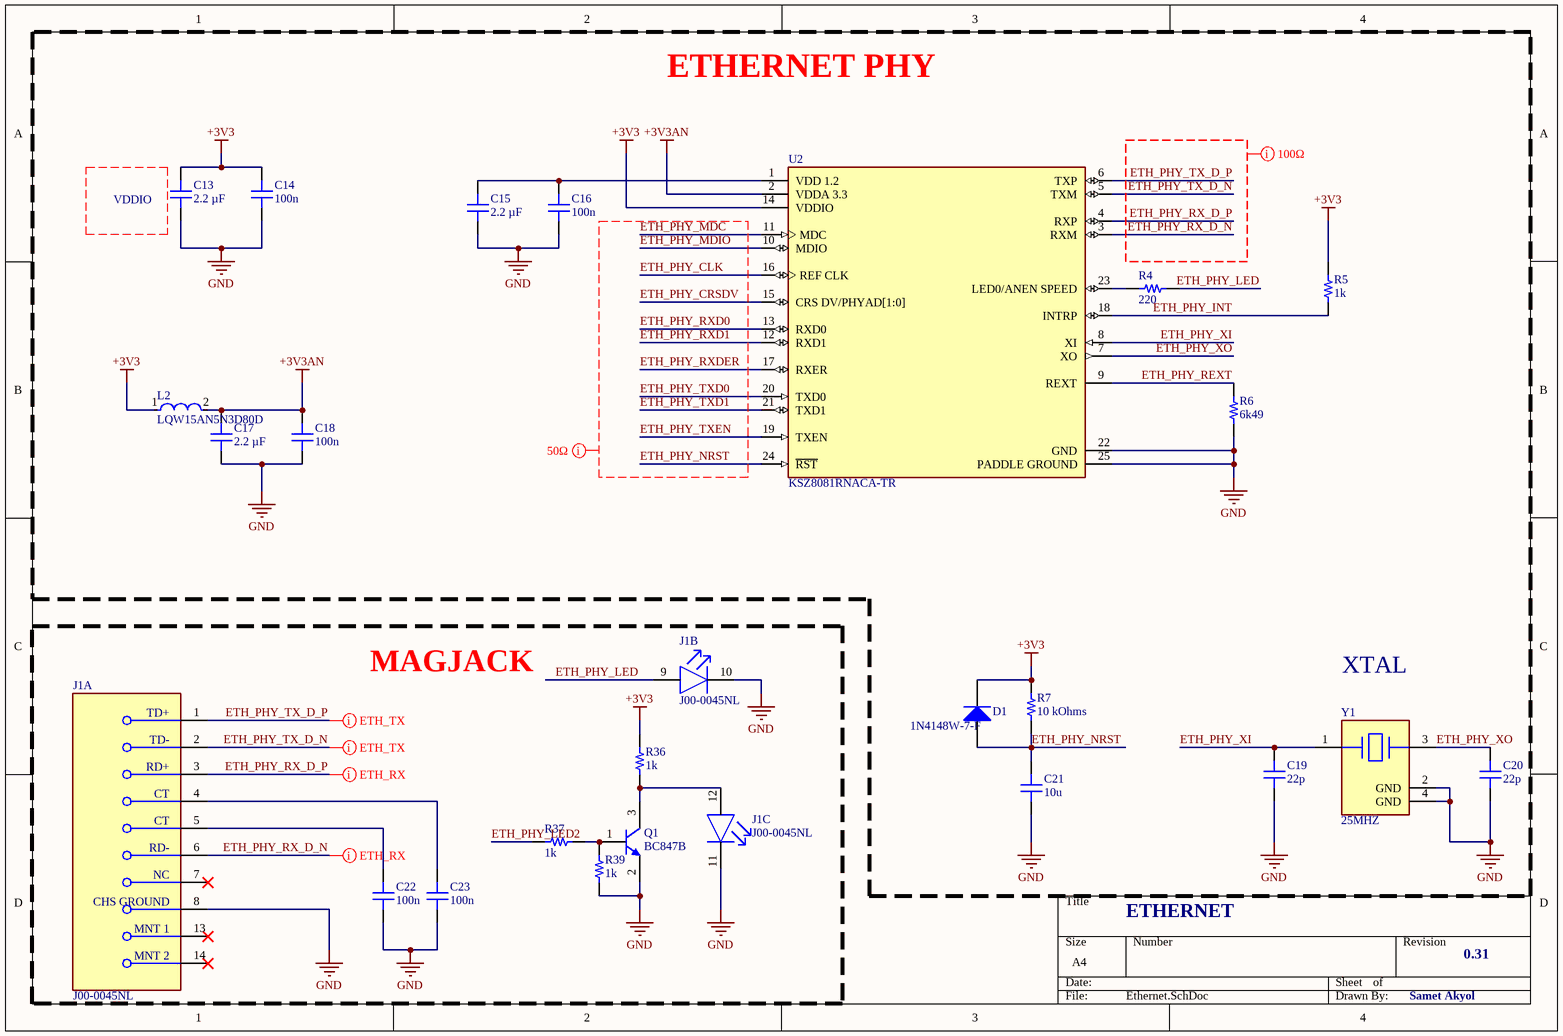
[diagram p2: Ethernet.SchDoc]

### Parts
C13  2.2 µF  [CAP 0402_1005]
C14  100n  [CAP 0402_1005]
C15  2.2 µF  [CAP 0402_1005]
C16  100n  [CAP 0402_1005]
C17  2.2 µF  [CAP 0402_1005]
C18  100n  [CAP 0402_1005]
C19  22p  [CAP 0402_1005]
C20  22p  [CAP 0402_1005]
C21  10u  [CAP 0402_1005]
C22  100n  [CAP 0402_1005]
C23  100n  [CAP 0402_1005]
D1  1N4148W-7-F  [DIOD-SOD123-2_V]
J1  J00-0045NL  [FP-J00-0045NL-MFG]  (parts A,B,C of 3)
L2  LQW15AN5N3D80D  [FP-LQW15AN_80-MFG]
Q1  BC847B  [INF-SOT23_M]
R4  220  [RES 0402_1005]
R5  1k  [RES 0402_1005]
R6  6k49  [RES 0402_1005]
R7  10 kOhms  [RES 0402_1005]
R36  1k  [RES 0402_1005]
R37  1k  [RES 0402_1005]
R39  1k  [RES 0402_1005]
U2  KSZ8081RNACA-TR  [FP-QFN44-24LD-PL-1-MFG]
Y1  25MHZ  [FP-ABM8G-MFG]

### Blocks framed on the sheet
ETHERNET PHY: C13-C21 D1 L2 R4-R7 U2 Y1
MAGJACK: C22 C23 J1 Q1 R36 R37 R39

### Nets
+3V3: C13.2 C14.2 D1.2(K) L2.1 R5.2 R7.2 R36.1 U2.14(VDDIO)
+3V3AN: C17.2 C18.2 L2.2 U2.2(VDDA_3.3)
GND: C13.1 C14.1 C15.1 C16.1 C17.1 C18.1 C19.1 C20.1 C21.1 C22.1 C23.1 J1.8(CHS_GROUND) J1.10(GREEN_C) J1.11(YELLOW_CATHODE) Q1.2(E) R6.1 R39.1 U2.22(GND) U2.25(PADDLE_GROUND) Y1.2(GND) Y1.4(GND)
ETH_PHY_CLK: U2.16(REF_CLK)
ETH_PHY_CRSDV: U2.15(CRS_DV/PHYAD[1:0])
ETH_PHY_INT: R5.1 U2.18(INTRP)
ETH_PHY_LED: J1.9(GREEN_A) R4.1
ETH_PHY_LED2: R37.2
ETH_PHY_MDC: U2.11(MDC)
ETH_PHY_MDIO: U2.10(MDIO)
ETH_PHY_NRST: C21.2 D1.1(A) R7.1 U2.24(~{RST})
ETH_PHY_REXT: R6.2 U2.9(REXT)
ETH_PHY_RX_D_N: J1.6(RD-) U2.3(RXM)
ETH_PHY_RX_D_P: J1.3(RD+) U2.4(RXP)
ETH_PHY_RXD0: U2.13(RXD0)
ETH_PHY_RXD1: U2.12(RXD1)
ETH_PHY_RXDER: U2.17(RXER)
ETH_PHY_TX_D_N: J1.2(TD-) U2.5(TXM)
ETH_PHY_TX_D_P: J1.1(TD+) U2.6(TXP)
ETH_PHY_TXD0: U2.20(TXD0)
ETH_PHY_TXD1: U2.21(TXD1)
ETH_PHY_TXEN: U2.19(TXEN)
ETH_PHY_XI: C19.2 U2.8(XI) Y1.1
ETH_PHY_XO: C20.2 U2.7(XO) Y1.3
NetC15_2: C15.2 C16.2 U2.1(VDD_1.2)
NetC22_2: C22.2 J1.5(CT)
NetC23_2: C23.2 J1.4(CT)
NetJ1_12: J1.12(YELLOW_ANODE) Q1.3(C) R36.2
NetQ1_1: Q1.1(B) R37.1 R39.2
NetR4_2: R4.2 U2.23(LED0/ANEN_SPEED)

Not connected (* = marked no-connect by the designer): J1 7(NC)* 13(MNT_1)* 14(MNT_2)*

### Layout directives
mark named 100Ω: ETH_PHY_RX_D_N, ETH_PHY_RX_D_P, ETH_PHY_TX_D_N, ETH_PHY_TX_D_P
differential pair: ETH_PHY_RX_D_N, ETH_PHY_RX_D_P, ETH_PHY_TX_D_N, ETH_PHY_TX_D_P
mark named 50Ω: ETH_PHY_CLK, ETH_PHY_CRSDV, ETH_PHY_MDC, ETH_PHY_MDIO, ETH_PHY_NRST, ETH_PHY_RXD0, ETH_PHY_RXD1, ETH_PHY_RXDER, ETH_PHY_TXD0, ETH_PHY_TXD1, ETH_PHY_TXEN

### Notes on the sheet
- (near C13) VDDIO
- XTAL
- ETHERNET
- 0.31
- Samet Akyol

### Library data of the parts
C13 C15 C17 = CL05A225KO5NQNC: as C9 on sheet Microcontroller; Part Number: CL05A225KO5NQNC; Value: 2.2 µF; Applications: General Purpose; Capacitance: 2.2 µF; componentlink1description: Datasheet; componentlink1url: http://www.samsungsem.com/kr/support/product-search/mlcc/CL05A225KO5NQNC.jsp; componentlink2description: DigiKey Link; componentlink2url: https://www.digikey.com/en/products/detail/samsung-electro-mechanics/CL05A225KO5NQNC/3887119; Device Package: 0402 (1005 Metric); lastupdated: 9.02.2024 20:04:38; Lifecycle Status: Active; Minimum Order: 1; Mounting Type: Surface Mount, MLCC; Operating Temperature: -55°C ~ 85°C; Package / Case: 0402 (1005 Metric); packaging: TapeAndReel; partid: 1761; Part Status: Active; price: 0.03; series: CL; Size / Dimension: 0.039" L x 0.020" W (1.00mm x 0.50mm); Supplier 1: DigiKey; Supplier Part Number 1: 1276-1461-1-ND; Temperature Coefficient: X5R; Thickness (Max): 0.022" (0.55mm); Voltage - Rated: 16V
C14 C16 C18-C20 C22 C23 = CL05B104KP5VPNC: as C1 on sheet Microcontroller; Part Number: CL05B104KP5VPNC; Applications: Automotive; componentlink1description: Datasheet; componentlink1url: https://mm.digikey.com/Volume0/opasdata/d220001/medias/docus/5458/CL05B104KP5VPNC_Spec.pdf; componentlink2description: DigiKey Link; componentlink2url: https://www.digikey.com/en/products/detail/samsung-electro-mechanics/CL05B104KP5VPNC/20498482; Device Package: 0402 (1005 Metric); lastupdated: 9.02.2024 20:03:17; Lifecycle Status: Active; Minimum Order: 1; Mounting Type: Surface Mount, MLCC; Operating Temperature: -55°C ~ 125°C; Package / Case: 0402 (1005 Metric); packaging: TapeAndReel; partid: 56690; price: 0.01; Ratings: AEC-Q200; series: CL; Size / Dimension: 0.039" L x 0.020" W (1.00mm x 0.50mm); Supplier 1: DigiKey; Supplier Part Number 1: 1276-CL05B104KP5VPNCCT-ND; Temperature Coefficient: X7R; Thickness (Max): 0.022" (0.55mm); Voltage - Rated: 10V
  C14 C16 C18 C22 C23: Value: 100n
  C19 C20: Value: 22p
C21 = CL05A225KO5NQNC: CAP CER 2.2UF 16V X5R 0402; manufacturer: Samsung Electro-Mechanics; Capacitance: 2.2 µF; Tolerance: ±10%; Part Number: CL05A225KO5NQNC; Value: 10u; Applications: General Purpose; componentlink1description: Datasheet; componentlink1url: http://www.samsungsem.com/kr/support/product-search/mlcc/CL05A225KO5NQNC.jsp; componentlink2description: DigiKey Link; componentlink2url: https://www.digikey.com/en/products/detail/samsung-electro-mechanics/CL05A225KO5NQNC/3887119; Device Package: 0402 (1005 Metric); lastupdated: 9.02.2024 20:04:38; Lifecycle Status: Active; Minimum Order: 1; Mounting Type: Surface Mount, MLCC; Operating Temperature: -55°C ~ 85°C; Package / Case: 0402 (1005 Metric); packaging: TapeAndReel; partid: 1761; Part Status: Active; price: 0.03; series: CL; Size / Dimension: 0.039" L x 0.020" W (1.00mm x 0.50mm); Supplier 1: DigiKey; Supplier Part Number 1: 1276-1461-1-ND; Temperature Coefficient: X5R; Thickness (Max): 0.022" (0.55mm); Voltage - Rated: 16V
D1 = CMP-2000-04932-2: Fast Switching Diode, 100 V, 0.15 A, -65 to 150 degC, 2-Pin?SOD123, RoHS, Tape and Reel; Recovery Time: 4ns; Brand: DiodesIncorporated; Unit Weight: 0.000353oz; Max Surge Current: 2A; Peak Reverse Voltage: 100V; Ir - Reverse Current: 1uA; Vf - Forward Voltage: 1.25V; Configuration: Single; If - Forward Current: 0.15A; Product Category: Diodes-GeneralPurpose,Power,Switching; Operating Temperature Range: -65Cto+150C; Packaging: Reel; Manufacturer URL: http://www.diodes.com/; Maximum Operating Temperature: +150C; Height: 1.25mm; Minimum Operating Temperature: -65C; Product: SwitchingDiodes; Package URL: http://www.diodes.com/datasheets/ds18004.pdf; Type: SwitchingDiode; Package Reference: SOD123-2; Width: 1.7mm; Datasheet URL: http://www.farnell.com/datasheets/1915529.pdf; Datasheet Version: Rev. 24-2, 10/2013; Series: 1N4148; Factory Pack Quantity: 3000; Length: 2.85mm; RoHS: True; Manufacturer: DiodesIncorporated; Mounting Style: SMD/SMT; Package / Case: SOD-123
J1 = CMP-16436-000005-1: CONN JACK 1PORT 100 BASE-TX PCB; Number of Cores per Jack: 4; Gender: Female; Connector Type: RJ45; Number of Positions Loaded: 8; Current Rating: 8mA; Pitch: 2.54mm; Shielding: Shielded; Direction: Down; Number of Ports: 1; Depth: 21.59mm; Radiation Hardening: No; Contact Material: Bronze; Contact Plating: Gold; Mount: Through Hole; Max Operating Temperature: 70°C; Packaging: Rail/Tube; Color: Green; Number of Contacts: 8; Lead Free: Lead Free; Series: STARJACK™ J00; Package Quantity: 30; Length: 16.26mm; Number of Rows: 1; Min Operating Temperature: 0°C; Termination: Solder; Orientation: Right Angle; Housing Material: Thermoplastic
L2 = CMP-06042-007060-1: as L1 on sheet Microcontroller; Case/Package: 0402; Height - Seated (Max): 0.024inch; Height: 0.5mm; Mount: Surface Mount; Inductance: 5.3nH; Width: 0.5mm; Package Quantity: 1; Packaging: Tape and Reel; Current Rating: 1.77A; Case Code (Metric): 1005; Length: 0.039inch; Case Code (Imperial): 0402; Resistor Type: Wirewound; Max Operating Temperature: 125°C; Termination: SMD/SMT; Min Operating Temperature: -55°C
Q1 = CMP-1177-00042-1: NPN Silicon AF Transistor, 45 V VCEO, 100 mA IC, SOT23, Reel, Green; Manufacturer: Infineon; VEBO (max): 6Â V; ICBO (max): 15Â nA; VCBO (max): 50Â V; IBM (max): 200Â mA; Green: TRUE; Ptot (max): 330Â mW; fT (typ): 250Â MHz; IC (max): 100Â mA; VCEO (max): 45Â V; PackageDescription: 3-Pin Small Outline Transistor Package, 1.3 x 2.9 mm Body, 0.95 mm Pitch; ComponentLink3URL: http://www.infineon.com/dgdl/SOT23-Package_Overview.pdf?folderId=db3a30431936bc4b0119532290053c66&fileId=db3a30431936bc4b0119533468123c85; PackageVersion: Apr-08; Packing: Reel; ComponentLink3Description: Package Specification; ComponentLink2URL: http://www.infineon.com/dgdl/bc847series_bc848series_bc849series_bc850series.pdf?folderId=db3a304314dca389011541d30fa21656&fileId=db3a304314dca389011541d4630a1657; ComponentLink1URL: http://www.infineon.com/; ComponentLink2Description: Datasheet; Polarity: NPN; Mounting Technology: Surface Mount; PackageReference: SOT23; ICM (max): 200Â mA; ComponentLink1Description: Manufacturer URL; PartNumber: BC847B
R4-R6 R36 R37 R39 = CPF0402B1K0E: as R14 on sheet Power; Part Number: CPF0402B1K0E; ComponentLink1Description: Datasheet; ComponentLink1URL: https://www.te.com/commerce/DocumentDelivery/DDEController?Action=srchrtrv&DocNm=1773200&DocType=DS&DocLang=English; ComponentLink2Description: DigiKey Link; ComponentLink2URL: https://www.digikey.com/en/products/detail/te-connectivity-passive-product/CPF0402B1K0E/4966468; Composition: Thin Film; Device Package: 0402 (1005 Metric); Height - Seated (Max): 0.014" (0.35mm); LastUpdated: 9.02.2024 20:30:24; Lifecycle Status: Active; Minimum Order: 1; Number of Terminations: 2; Operating Temperature: -55°C ~ 155°C; Package / Case: 0402 (1005 Metric); Packaging: TapeAndReel; PartId: 2470; Part Status: Active; Price: 0.10; Series: CPF, Neohm; Size / Dimension: 0.039" L x 0.020" W (1.00mm x 0.50mm); Supplier 1: DigiKey; Supplier Part Number 1: A119928CT-ND; Supplier Device Package: 0402; Tolerance: ±0.1%
  R4: Value: 220
  R5 R36 R37 R39: Value: 1k
  R6: Value: 6k49
R7 = RP73PF1E10KBTD: RES 10K OHM 0.1% 1/10W 0402; Manufacturer: TE Connectivity Passive Product; Power (Watts): 0.1W, 1/10W; Temperature Coefficient: ±25ppm/°C; Part Number: RP73PF1E10KBTD; Value: 10 kOhms; ComponentLink1Description: Datasheet; ComponentLink1URL: https://www.te.com/commerce/DocumentDelivery/DDEController?Action=srchrtrv&DocNm=1773272&DocType=DS&DocLang=English; ComponentLink2Description: DigiKey Link; ComponentLink2URL: https://www.digikey.com/en/products/detail/te-connectivity-passive-product/RP73PF1E10KBTD/8260957; Composition: Thin Film; Device Package: 0402 (1005 Metric); Height - Seated (Max): 0.014" (0.35mm); LastUpdated: 9.02.2024 20:30:24; Lifecycle Status: Active; Minimum Order: 1; Number of Terminations: 2; Operating Temperature: -55°C ~ 155°C; Package / Case: 0402 (1005 Metric); Packaging: TapeAndReel; PartId: 2434; Part Status: Active; Price: 0.08; Resistance: 10 kOhms; Series: RP73, Holsworthy; Size / Dimension: 0.039" L x 0.020" W (1.00mm x 0.50mm); Supplier 1: DigiKey; Supplier Part Number 1: A127415CT-ND; Supplier Device Package: 0402; Tolerance: ±0.1%
U2 = CMP-2000-06521-2: IC TRANSCEIVER FULL 1/1 24QFN; Manufacturer: Microchip; Interface: Ethernet,Other; Number Of Channels: 1; Data Rate: 100Mbits/s; Standoff Height: 0.02mm; Min Supply Voltage: 1.71V; Simplex Duplex: Full Duplex; Max Junction Temp: +125°C; Nominal Supply Current: 20-47mA; Max Supply Voltage: 3.465V; Lead Free: Yes; Ambient Temperature Range Low: 0°C; RoHS: TRUE; Ambient Temperature Range High: +70°C; Device Class L2: Interface ICs; Device Class L3: Ethernet Interface ICs; Temperature Range High: +125°C; ComponentLink2Description: Datasheet; Height: 0.9mm; ComponentLink2URL: http://ww1.microchip.com/downloads/en/DeviceDoc/KSZ8081RNA-RND-10BASE-T-100BASE-TX-PHY-with-RMII-Support-DS00002199B.pdf; Automotive: No; Digikey Description: IC TRANSCEIVER FULL 1/1 24QFN; Package: QFN44-24LD-PL-1; Manufacturer Part Number: KSZ8081RNACA-TR; Device Class L1: Integrated Circuits (ICs); Mouser Description: Ethernet ICs 10/100 PHY,  0.11u; Category: IC; Octopart: https://octopart.com/ksz8081rnaca-tr-microchip-66799960; Ipc Land Pattern Name: QFN50P400X400X85-24; Temperature: to +125°C
Y1 = CMP-2000-05733-3: as Y2 on sheet Microcontroller; Length: 3.2mm; Depth: 2.5mm; Packaging: Tape and Reel; Min Operating Temperature: -40°C; Operating Frequency: 25 MHz; Lead Free: Lead Free; Number of Pins: 4; Frequency Tolerance: 20ppm; Radiation Hardening: No; Max Operating Temperature: 85°C; Termination: SMD/SMT; Frequency Stability: 30ppm; Frequency: 25MHz; Series: ABM8G; Mount: Surface Mount; Package Quantity: 1000; Height: 0.039inch; Width: 0.098inch; Case/Package: CSMD; ESR (Equivalent Series Resistance): 60R; Load Capacitance: 18pF; Tolerance: 20ppm